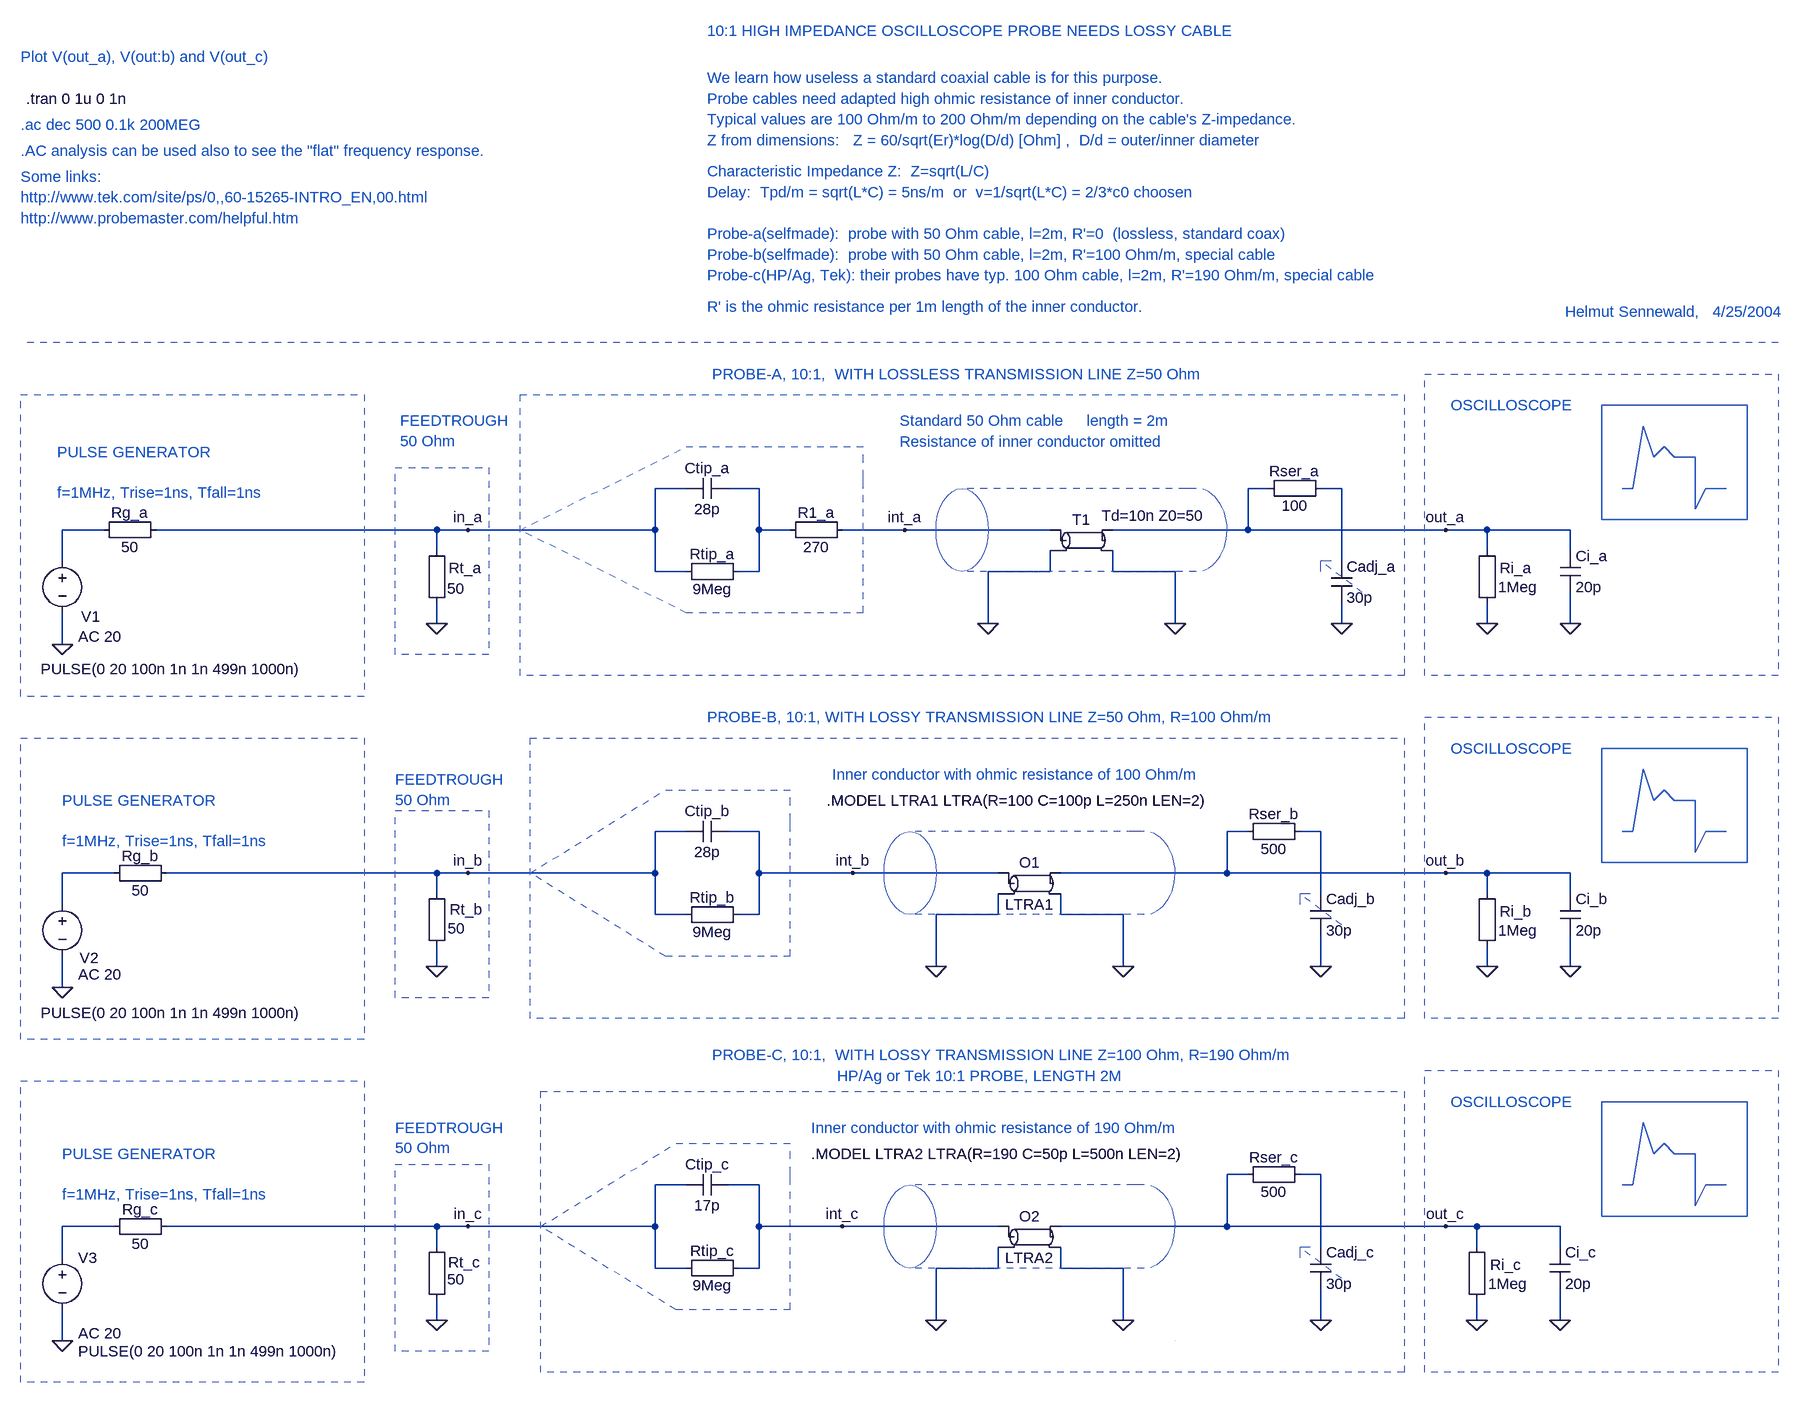
[diagram p0: schematic ltc002_OSC_Probe.asc]
ltc002_OSC_Probe.asc, the LTspice schematic file:
Version 4
SHEET 1 2036 1860
WIRE -144 32 -192 32
WIRE -32 32 -80 32
WIRE 752 32 720 32
WIRE 864 32 832 32
WIRE -1040 96 -1104 96
WIRE -528 96 -960 96
WIRE -480 96 -528 96
WIRE -192 96 -192 32
WIRE -192 96 -480 96
WIRE -32 96 -32 32
WIRE 16 96 -32 96
WIRE 192 96 96 96
WIRE 416 96 192 96
WIRE 720 96 720 32
WIRE 720 96 512 96
WIRE 1024 96 720 96
WIRE 1088 96 1024 96
WIRE 1216 96 1088 96
WIRE -528 128 -528 96
WIRE 1088 128 1088 96
WIRE 1216 128 1216 96
WIRE -1104 144 -1104 96
WIRE 864 144 864 32
WIRE -192 160 -192 96
WIRE -144 160 -192 160
WIRE -32 160 -32 96
WIRE -32 160 -64 160
WIRE 416 160 416 128
WIRE 416 160 320 160
WIRE 512 160 512 128
WIRE 608 160 512 160
WIRE -528 240 -528 208
WIRE 320 240 320 160
WIRE 608 240 608 160
WIRE 864 240 864 208
WIRE 1088 240 1088 208
WIRE 1216 240 1216 192
WIRE -1104 272 -1104 224
WIRE -144 560 -192 560
WIRE -32 560 -80 560
WIRE 720 560 688 560
WIRE 832 560 800 560
WIRE -1024 624 -1104 624
WIRE -528 624 -944 624
WIRE -480 624 -528 624
WIRE -192 624 -192 560
WIRE -192 624 -480 624
WIRE -32 624 -32 560
WIRE 112 624 -32 624
WIRE 336 624 112 624
WIRE 688 624 688 560
WIRE 688 624 432 624
WIRE 1024 624 688 624
WIRE 1088 624 1024 624
WIRE 1216 624 1088 624
WIRE -528 656 -528 624
WIRE 832 656 832 560
WIRE 1088 656 1088 624
WIRE 1216 656 1216 624
WIRE -1104 672 -1104 624
WIRE -192 688 -192 624
WIRE -144 688 -192 688
WIRE -32 688 -32 624
WIRE -32 688 -64 688
WIRE 336 688 336 656
WIRE 336 688 240 688
WIRE 432 688 432 656
WIRE 528 688 432 688
WIRE -528 768 -528 736
WIRE 240 768 240 688
WIRE 528 768 528 688
WIRE 832 768 832 720
WIRE 1088 768 1088 736
WIRE 1216 768 1216 720
WIRE -1104 800 -1104 752
WIRE 720 1088 688 1088
WIRE 832 1088 800 1088
WIRE -144 1104 -192 1104
WIRE -32 1104 -80 1104
WIRE -1024 1168 -1104 1168
WIRE -528 1168 -944 1168
WIRE -480 1168 -528 1168
WIRE -192 1168 -192 1104
WIRE -192 1168 -480 1168
WIRE -32 1168 -32 1104
WIRE 96 1168 -32 1168
WIRE 336 1168 96 1168
WIRE 688 1168 688 1088
WIRE 688 1168 432 1168
WIRE 1024 1168 688 1168
WIRE 1072 1168 1024 1168
WIRE 1200 1168 1072 1168
WIRE -528 1200 -528 1168
WIRE 832 1200 832 1088
WIRE 1072 1200 1072 1168
WIRE 1200 1200 1200 1168
WIRE -1104 1216 -1104 1168
WIRE -192 1232 -192 1168
WIRE -144 1232 -192 1232
WIRE -32 1232 -32 1168
WIRE -32 1232 -64 1232
WIRE 336 1232 336 1200
WIRE 336 1232 240 1232
WIRE 432 1232 432 1200
WIRE 528 1232 432 1232
WIRE -528 1312 -528 1280
WIRE 240 1312 240 1232
WIRE 528 1312 528 1232
WIRE 832 1312 832 1264
WIRE 1072 1312 1072 1280
WIRE 1200 1312 1200 1264
WIRE -1104 1344 -1104 1296
FLAG 320 240 0
FLAG 608 240 0
FLAG -1104 272 0
FLAG 864 240 0
FLAG 1088 240 0
FLAG 1216 240 0
FLAG 1024 96 out_a
FLAG -480 96 in_a
FLAG 192 96 int_a
FLAG -1104 800 0
FLAG 832 768 0
FLAG 1088 768 0
FLAG 1216 768 0
FLAG 1024 624 out_b
FLAG -480 624 in_b
FLAG 112 624 int_b
FLAG -528 240 0
FLAG -528 768 0
FLAG -1104 1344 0
FLAG 832 1312 0
FLAG 1072 1312 0
FLAG 1200 1312 0
FLAG 1024 1168 out_c
FLAG -480 1168 in_c
FLAG 96 1168 int_c
FLAG -528 1312 0
FLAG 240 768 0
FLAG 528 768 0
FLAG 240 1312 0
FLAG 528 1312 0
SYMBOL voltage -1104 128 R0
WINDOW 3 -33 182 Left 2
WINDOW 123 24 132 Left 2
WINDOW 39 0 0 Left 2
WINDOW 0 29 101 Left 2
SYMATTR Value PULSE(0 20 100n 1n 1n 499n 1000n)
SYMATTR Value2 AC 20
SYMATTR InstName V1
SYMBOL tline 464 112 R0
WINDOW 3 31 -38 Left 2
SYMATTR Value Td=10n Z0=50
SYMATTR InstName T1
SYMBOL cap 848 144 R0
SYMATTR InstName Cadj_a
SYMATTR Value 30p
SYMBOL cap -144 48 R270
WINDOW 0 32 32 VTop 2
WINDOW 3 0 32 VBottom 2
SYMATTR InstName Ctip_a
SYMATTR Value 28p
SYMBOL cap 1200 128 R0
SYMATTR InstName Ci_a
SYMATTR Value 20p
SYMBOL voltage -1104 656 R0
WINDOW 3 -33 183 Left 2
WINDOW 123 24 124 Left 2
WINDOW 39 0 0 Left 2
WINDOW 0 27 99 Left 2
SYMATTR Value PULSE(0 20 100n 1n 1n 499n 1000n)
SYMATTR Value2 AC 20
SYMATTR InstName V2
SYMBOL cap 816 656 R0
SYMATTR InstName Cadj_b
SYMATTR Value 30p
SYMBOL cap -144 576 R270
WINDOW 0 32 32 VTop 2
WINDOW 3 0 32 VBottom 2
SYMATTR InstName Ctip_b
SYMATTR Value 28p
SYMBOL cap 1200 656 R0
SYMATTR InstName Ci_b
SYMATTR Value 20p
SYMBOL ltline 384 640 R0
SYMATTR InstName O1
SYMATTR Value LTRA1
SYMBOL voltage -1104 1200 R0
WINDOW 3 24 160 Left 2
WINDOW 123 24 132 Left 2
WINDOW 39 0 0 Left 2
SYMATTR Value PULSE(0 20 100n 1n 1n 499n 1000n)
SYMATTR Value2 AC 20
SYMATTR InstName V3
SYMBOL cap 816 1200 R0
SYMATTR InstName Cadj_c
SYMATTR Value 30p
SYMBOL cap -144 1120 R270
WINDOW 0 32 32 VTop 2
WINDOW 3 0 32 VBottom 2
SYMATTR InstName Ctip_c
SYMATTR Value 17p
SYMBOL cap 1184 1200 R0
SYMATTR InstName Ci_c
SYMATTR Value 20p
SYMBOL ltline 384 1184 R0
SYMATTR InstName O2
SYMATTR Value LTRA2
SYMBOL Misc\\EuropeanResistor -944 80 R90
WINDOW 0 5 56 VBottom 2
WINDOW 3 27 56 VTop 2
SYMATTR InstName Rg_a
SYMATTR Value 50
SYMBOL Misc\\EuropeanResistor -928 608 R90
WINDOW 0 5 56 VBottom 2
WINDOW 3 27 56 VTop 2
SYMATTR InstName Rg_b
SYMATTR Value 50
SYMBOL Misc\\EuropeanResistor -928 1152 R90
WINDOW 0 5 56 VBottom 2
WINDOW 3 27 56 VTop 2
SYMATTR InstName Rg_c
SYMATTR Value 50
SYMBOL Misc\\EuropeanResistor -512 224 R180
WINDOW 0 -53 69 Left 2
WINDOW 3 -27 38 Left 2
SYMATTR InstName Rt_a
SYMATTR Value 50
SYMBOL Misc\\EuropeanResistor -512 752 R180
WINDOW 0 -55 72 Left 2
WINDOW 3 -28 43 Left 2
SYMATTR InstName Rt_b
SYMATTR Value 50
SYMBOL Misc\\EuropeanResistor -512 1296 R180
WINDOW 0 -51 73 Left 2
WINDOW 3 -27 47 Left 2
SYMATTR InstName Rt_c
SYMATTR Value 50
SYMBOL Misc\\EuropeanResistor -48 144 R90
WINDOW 0 5 56 VBottom 2
WINDOW 3 27 56 VTop 2
SYMATTR InstName Rtip_a
SYMATTR Value 9Meg
SYMBOL Misc\\EuropeanResistor -48 672 R90
WINDOW 0 5 56 VBottom 2
WINDOW 3 27 56 VTop 2
SYMATTR InstName Rtip_b
SYMATTR Value 9Meg
SYMBOL Misc\\EuropeanResistor -48 1216 R90
WINDOW 0 5 56 VBottom 2
WINDOW 3 27 56 VTop 2
SYMATTR InstName Rtip_c
SYMATTR Value 9Meg
SYMBOL Misc\\EuropeanResistor 848 16 R90
WINDOW 0 5 56 VBottom 2
WINDOW 3 27 56 VTop 2
SYMATTR InstName Rser_a
SYMATTR Value 100
SYMBOL Misc\\EuropeanResistor 816 544 R90
WINDOW 0 5 56 VBottom 2
WINDOW 3 27 56 VTop 2
SYMATTR InstName Rser_b
SYMATTR Value 500
SYMBOL Misc\\EuropeanResistor 816 1072 R90
WINDOW 0 5 56 VBottom 2
WINDOW 3 27 56 VTop 2
SYMATTR InstName Rser_c
SYMATTR Value 500
SYMBOL Misc\\EuropeanResistor 1104 224 R180
WINDOW 0 -53 69 Left 2
WINDOW 3 -62 40 Left 2
SYMATTR InstName Ri_a
SYMATTR Value 1Meg
SYMBOL Misc\\EuropeanResistor 1104 752 R180
WINDOW 0 -53 69 Left 2
WINDOW 3 -62 40 Left 2
SYMATTR InstName Ri_b
SYMATTR Value 1Meg
SYMBOL Misc\\EuropeanResistor 1088 1296 R180
WINDOW 0 -53 69 Left 2
WINDOW 3 -62 40 Left 2
SYMATTR InstName Ri_c
SYMATTR Value 1Meg
SYMBOL Misc\\EuropeanResistor 112 80 R90
WINDOW 0 5 56 VBottom 2
WINDOW 3 27 56 VTop 2
SYMATTR InstName R1_a
SYMATTR Value 270
TEXT -1168 -528 Left 2 ;.ac dec 500 0.1k 200MEG
TEXT -1160 -568 Left 2 !.tran 0 1u 0 1n
TEXT 72 512 Left 2 !.MODEL LTRA1 LTRA(R=100 C=100p L=250n LEN=2)
TEXT -112 384 Left 2 ;PROBE-B, 10:1, WITH LOSSY TRANSMISSION LINE Z=50 Ohm, R=100 Ohm/m
TEXT -104 -144 Left 2 ;PROBE-A, 10:1,  WITH LOSSLESS TRANSMISSION LINE Z=50 Ohm
TEXT 48 1056 Left 2 !.MODEL LTRA2 LTRA(R=190 C=50p L=500n LEN=2)
TEXT -104 904 Left 2 ;PROBE-C, 10:1,  WITH LOSSY TRANSMISSION LINE Z=100 Ohm, R=190 Ohm/m
TEXT -112 -672 Left 2 ;10:1 HIGH IMPEDANCE OSCILLOSCOPE PROBE NEEDS LOSSY CABLE
TEXT -112 -360 Left 2 ;Probe-a(selfmade):  probe with 50 Ohm cable, l=2m, R'=0  (lossless, standard coax)
TEXT -112 -328 Left 2 ;Probe-b(selfmade):  probe with 50 Ohm cable, l=2m, R'=100 Ohm/m, special cable
TEXT -112 -296 Left 2 ;Probe-c(HP/Ag, Tek): their probes have typ. 100 Ohm cable, l=2m, R'=190 Ohm/m, special cable
TEXT -112 -248 Left 2 ;R' is the ohmic resistance per 1m length of the inner conductor.
TEXT -1168 -488 Left 2 ;.AC analysis can be used also to see the "flat" frequency response.
TEXT -112 -456 Left 2 ;Characteristic Impedance Z:  Z=sqrt(L/C)
TEXT 1032 -96 Left 2 ;OSCILLOSCOPE
TEXT 472 -72 Left 2 ;length = 2m
TEXT -1112 -24 Left 2 ;PULSE GENERATOR\n \nf=1MHz, Trise=1ns, Tfall=1ns
TEXT -584 -72 Left 2 ;FEEDTROUGH\n50 Ohm
TEXT -592 480 Left 2 ;FEEDTROUGH\n50 Ohm
TEXT -592 1016 Left 2 ;FEEDTROUGH\n50 Ohm
TEXT 1032 976 Left 2 ;OSCILLOSCOPE
TEXT 1032 432 Left 2 ;OSCILLOSCOPE
TEXT 80 472 Left 2 ;Inner conductor with ohmic resistance of 100 Ohm/m
TEXT 48 1016 Left 2 ;Inner conductor with ohmic resistance of 190 Ohm/m
TEXT 184 -72 Left 2 ;Standard 50 Ohm cable
TEXT 184 -40 Left 2 ;Resistance of inner conductor omitted
TEXT -1104 512 Left 2 ;PULSE GENERATOR\n \nf=1MHz, Trise=1ns, Tfall=1ns
TEXT -1104 1056 Left 2 ;PULSE GENERATOR\n \nf=1MHz, Trise=1ns, Tfall=1ns
TEXT -112 -600 Left 2 ;We learn how useless a standard coaxial cable is for this purpose.
TEXT -112 -568 Left 2 ;Probe cables need adapted high ohmic resistance of inner conductor.
TEXT -112 -424 Left 2 ;Delay:  Tpd/m = sqrt(L*C) = 5ns/m  or  v=1/sqrt(L*C) = 2/3*c0 choosen
TEXT 1208 -240 Left 2 ;Helmut Sennewald,   4/25/2004
TEXT -112 -536 Left 2 ;Typical values are 100 Ohm/m to 200 Ohm/m depending on the cable's Z-impedance.
TEXT -112 -504 Left 2 ;Z from dimensions:   Z = 60/sqrt(Er)*log(D/d) [Ohm] ,  D/d = outer/inner diameter
TEXT 88 936 Left 2 ;HP/Ag or Tek 10:1 PROBE, LENGTH 2M
TEXT -1168 -416 Left 2 ;http://www.tek.com/site/ps/0,,60-15265-INTRO_EN,00.html
TEXT -1168 -384 Left 2 ;http://www.probemaster.com/helpful.htm
TEXT -1168 -448 Left 2 ;Some links:
TEXT -1168 -632 Left 2 ;Plot V(out_a), V(out:b) and V(out_c)
LINE Normal 624 32 288 32 2
LINE Normal 640 32 624 32 2
LINE Normal 640 32 640 32 2
LINE Normal 640 160 288 160 2
LINE Normal -144 -32 128 -32 2
LINE Normal -400 96 -144 -32 2
LINE Normal -144 224 -400 96 2
LINE Normal 128 224 -144 224 2
LINE Normal 128 224 128 224 2
LINE Normal 1312 32 1296 32
LINE Normal 1328 -64 1312 32
LINE Normal 1344 -16 1328 -64
LINE Normal 1360 -32 1344 -16
LINE Normal 1376 -16 1360 -32
LINE Normal 1408 -16 1376 -16
LINE Normal 1408 64 1408 -16
LINE Normal 1424 32 1408 64
LINE Normal 1456 32 1424 32
LINE Normal 544 560 208 560 2
LINE Normal 560 560 544 560 2
LINE Normal 560 560 560 560 2
LINE Normal 544 1104 208 1104 2
LINE Normal 560 1104 544 1104 2
LINE Normal 560 1104 560 1104 2
LINE Normal 560 1232 208 1232 2
LINE Normal 1312 560 1296 560
LINE Normal 1328 464 1312 560
LINE Normal 1344 512 1328 464
LINE Normal 1360 496 1344 512
LINE Normal 1376 512 1360 496
LINE Normal 1408 512 1376 512
LINE Normal 1408 592 1408 512
LINE Normal 1424 560 1408 592
LINE Normal 1456 560 1424 560
LINE Normal 1312 1104 1296 1104
LINE Normal 1328 1008 1312 1104
LINE Normal 1344 1056 1328 1008
LINE Normal 1360 1040 1344 1056
LINE Normal 1376 1056 1360 1040
LINE Normal 1408 1056 1376 1056
LINE Normal 1408 1136 1408 1056
LINE Normal 1424 1104 1408 1136
LINE Normal 1456 1104 1424 1104
LINE Normal 560 512 560 512 2
LINE Normal 560 688 208 688 2
LINE Normal 608 1344 608 1344 2
LINE Normal 128 16 128 -32 2
LINE Normal 128 32 128 16 2
LINE Normal 128 224 128 160 2
LINE Normal 128 160 128 32 2
LINE Normal -176 496 16 496 2
LINE Normal -384 624 -176 496 2
LINE Normal -176 752 -384 624 2
LINE Normal 16 752 -176 752 2
LINE Normal 16 752 16 752 2
LINE Normal 16 544 16 496 2
LINE Normal 16 560 16 544 2
LINE Normal 16 752 16 688 2
LINE Normal 16 688 16 560 2
LINE Normal -160 1040 16 1040 2
LINE Normal -368 1168 -160 1040 2
LINE Normal -160 1296 -368 1168 2
LINE Normal 16 1296 -160 1296 2
LINE Normal 16 1296 16 1296 2
LINE Normal 16 1088 16 1040 2
LINE Normal 16 1104 16 1088 2
LINE Normal 16 1296 16 1232 2
LINE Normal 16 1232 16 1104 2
LINE Normal 896 192 832 144 2
LINE Normal 848 144 832 144 2
LINE Normal 832 160 832 144 2
LINE Normal 864 704 800 656 2
LINE Normal 816 656 800 656 2
LINE Normal 800 672 800 656 2
LINE Normal 864 1248 800 1200 2
LINE Normal 816 1200 800 1200 2
LINE Normal 800 1216 800 1200 2
LINE Normal 1536 -192 -1168 -192 2
RECTANGLE Normal 1536 320 992 -144 2
RECTANGLE Normal 1488 80 1264 -96
RECTANGLE Normal -640 352 -1168 -112 2
RECTANGLE Normal -448 288 -592 0 2
RECTANGLE Normal -640 880 -1168 416 2
RECTANGLE Normal -640 1408 -1168 944 2
RECTANGLE Normal -448 816 -592 528 2
RECTANGLE Normal -448 1360 -592 1072 2
RECTANGLE Normal 1536 848 992 384 2
RECTANGLE Normal 1536 1392 992 928 2
RECTANGLE Normal 1488 608 1264 432
RECTANGLE Normal 1488 1152 1264 976
RECTANGLE Normal 960 320 -400 -112 1
RECTANGLE Normal 960 848 -384 416 1
RECTANGLE Normal 960 1392 -368 960 1
CIRCLE Normal 320 160 240 32 2
CIRCLE Normal 240 688 160 560 2
CIRCLE Normal 240 1232 160 1104 2
ARC Normal 592 32 688 160 646 133 653 16 2
ARC Normal 512 560 608 688 566 661 573 544 2
ARC Normal 512 1104 608 1232 566 1205 573 1088 2

The netlist it stands for:
* ltc002_OSC_Probe.asc
V1 N003 0 PULSE(0 20 100n 1n 1n 499n 1000n) AC 20
T1 int_a 0 out_a 0 Td=10n Z0=50
Cadj_a N002 0 30p
Ctip_a in_a N001 28p
Ci_a out_a 0 20p
V2 N005 0 PULSE(0 20 100n 1n 1n 499n 1000n) AC 20
Cadj_b N004 0 30p
Ctip_b in_b int_b 28p
Ci_b out_b 0 20p
O1 int_b 0 out_b 0 LTRA1
V3 N007 0 PULSE(0 20 100n 1n 1n 499n 1000n) AC 20
Cadj_c N006 0 30p
Ctip_c in_c int_c 17p
Ci_c out_c 0 20p
O2 int_c 0 out_c 0 LTRA2
Rg_a in_a N003 50
Rg_b in_b N005 50
Rg_c in_c N007 50
Rt_a 0 in_a 50
Rt_b 0 in_b 50
Rt_c 0 in_c 50
Rtip_a N001 in_a 9Meg
Rtip_b int_b in_b 9Meg
Rtip_c int_c in_c 9Meg
Rser_a N002 out_a 100
Rser_b N004 out_b 500
Rser_c N006 out_c 500
Ri_a 0 out_a 1Meg
Ri_b 0 out_b 1Meg
Ri_c 0 out_c 1Meg
R1_a int_a N001 270
* .ac dec 500 0.1k 200MEG
.tran 0 1u 0 1n
.MODEL LTRA1 LTRA(R=100 C=100p L=250n LEN=2)
* PROBE-B, 10:1, WITH LOSSY TRANSMISSION LINE Z=50 Ohm, R=100 Ohm/m
* PROBE-A, 10:1,  WITH LOSSLESS TRANSMISSION LINE Z=50 Ohm
.MODEL LTRA2 LTRA(R=190 C=50p L=500n LEN=2)
* PROBE-C, 10:1,  WITH LOSSY TRANSMISSION LINE Z=100 Ohm, R=190 Ohm/m
* 10:1 HIGH IMPEDANCE OSCILLOSCOPE PROBE NEEDS LOSSY CABLE
* Probe-a(selfmade):  probe with 50 Ohm cable, l=2m, R'=0  (lossless, standard coax)
* Probe-b(selfmade):  probe with 50 Ohm cable, l=2m, R'=100 Ohm/m, special cable
* Probe-c(HP/Ag, Tek): their probes have typ. 100 Ohm cable, l=2m, R'=190 Ohm/m, special cable
* R' is the ohmic resistance per 1m length of the inner conductor.
* .AC analysis can be used also to see the "flat" frequency response.
* Characteristic Impedance Z:  Z=sqrt(L/C)
* OSCILLOSCOPE
* length = 2m
* PULSE GENERATOR
* f=1MHz, Trise=1ns, Tfall=1ns
* FEEDTROUGH
* 50 Ohm
* FEEDTROUGH
* 50 Ohm
* FEEDTROUGH
* 50 Ohm
* OSCILLOSCOPE
* OSCILLOSCOPE
* Inner conductor with ohmic resistance of 100 Ohm/m
* Inner conductor with ohmic resistance of 190 Ohm/m
* Standard 50 Ohm cable
* Resistance of inner conductor omitted
* PULSE GENERATOR
* f=1MHz, Trise=1ns, Tfall=1ns
* PULSE GENERATOR
* f=1MHz, Trise=1ns, Tfall=1ns
* We learn how useless a standard coaxial cable is for this purpose.
* Probe cables need adapted high ohmic resistance of inner conductor.
* Delay:  Tpd/m = sqrt(L*C) = 5ns/m  or  v=1/sqrt(L*C) = 2/3*c0 choosen
* Helmut Sennewald,   4/25/2004
* Typical values are 100 Ohm/m to 200 Ohm/m depending on the cable's Z-impedance.
* Z from dimensions:   Z = 60/sqrt(Er)*log(D/d) [Ohm] ,  D/d = outer/inner diameter
* HP/Ag or Tek 10:1 PROBE, LENGTH 2M
* http://www.tek.com/site/ps/0,,60-15265-INTRO_EN,00.html
* http://www.probemaster.com/helpful.htm
* Some links:
* Plot V(out_a), V(out:b) and V(out_c)
.backanno
.end

* Results of the author's LTspice run, read from the files saved beside the schematic
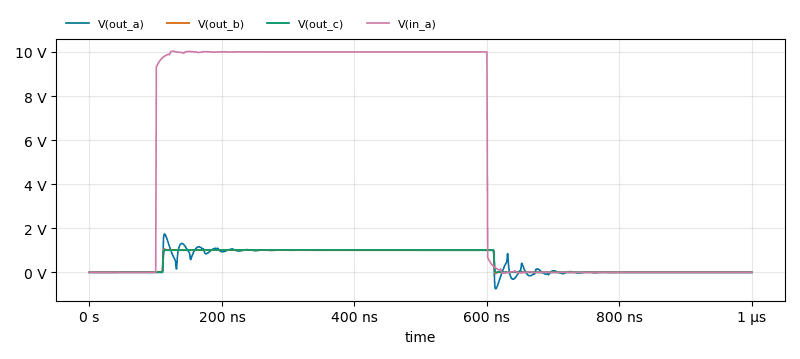
[diagram p1: Transient Analysis of ltc002_OSC_Probe.asc, plotted from the saved traces]
* Transient Analysis, 1 run:
*   V(out_a): min -748.5 mV, max 1.745 V, average 500.2 mV, rms 721.3 mV, last -1.244 mV
*   V(out_b): min -54.89 mV, max 1.057 V, average 503 mV, rms 711 mV, last 39.92 µV
*   V(out_c): min -7.692 mV, max 1.024 V, average 508.4 mV, rms 718 mV, last 33.58 µV
*   V(in_a): min -30.74 mV, max 10.03 V, average 5 V, rms 7.061 V, last 0 V